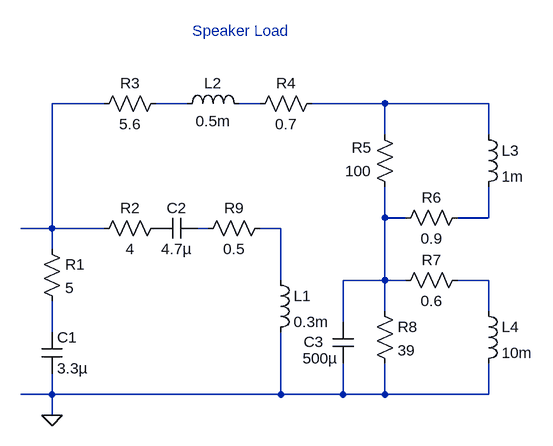
[diagram p0: schematic SpeakerLoad.asc]
SpeakerLoad.asc, the LTspice schematic file:
Version 4
SHEET 1 1868 1444
WIRE 1120 1136 1072 1136
WIRE 1120 1136 1120 944
WIRE 1120 1168 1120 1136
WIRE 1120 1296 1120 1248
WIRE 1120 1392 1072 1392
WIRE 1120 1392 1120 1360
WIRE 1120 1424 1120 1392
WIRE 1200 944 1120 944
WIRE 1200 1136 1120 1136
WIRE 1328 944 1280 944
WIRE 1360 1136 1344 1136
WIRE 1440 944 1408 944
WIRE 1472 1136 1440 1136
WIRE 1472 1216 1472 1136
WIRE 1472 1392 1120 1392
WIRE 1472 1392 1472 1296
WIRE 1568 1280 1568 1216
WIRE 1568 1392 1472 1392
WIRE 1568 1392 1568 1344
WIRE 1632 944 1520 944
WIRE 1632 992 1632 944
WIRE 1632 1120 1632 1072
WIRE 1632 1216 1568 1216
WIRE 1632 1216 1632 1120
WIRE 1632 1264 1632 1216
WIRE 1632 1392 1568 1392
WIRE 1632 1392 1632 1344
WIRE 1664 1120 1632 1120
WIRE 1664 1216 1632 1216
WIRE 1792 944 1632 944
WIRE 1792 992 1792 944
WIRE 1792 1120 1744 1120
WIRE 1792 1120 1792 1072
WIRE 1792 1216 1744 1216
WIRE 1792 1264 1792 1216
WIRE 1792 1392 1632 1392
WIRE 1792 1392 1792 1344
FLAG 1120 1424 0
SYMBOL res 1104 1152 R0
SYMATTR InstName R1
SYMATTR Value 5
SYMBOL res 1296 1120 R90
WINDOW 0 0 56 VBottom 0
WINDOW 3 32 56 VTop 0
SYMATTR InstName R2
SYMATTR Value 4
SYMBOL res 1296 928 R90
WINDOW 0 0 56 VBottom 0
WINDOW 3 32 56 VTop 0
SYMATTR InstName R3
SYMATTR Value 5.6
SYMBOL res 1536 928 R90
WINDOW 0 0 56 VBottom 0
WINDOW 3 32 56 VTop 0
SYMATTR InstName R4
SYMATTR Value 0.7
SYMBOL res 1648 1088 R180
WINDOW 0 36 76 Left 0
WINDOW 3 36 40 Left 0
SYMATTR InstName R5
SYMATTR Value 100
SYMBOL res 1648 1136 R270
WINDOW 0 32 56 VTop 0
WINDOW 3 0 56 VBottom 0
SYMATTR InstName R6
SYMATTR Value 0.9
SYMBOL res 1648 1232 R270
WINDOW 0 32 56 VTop 0
WINDOW 3 0 56 VBottom 0
SYMATTR InstName R7
SYMATTR Value 0.6
SYMBOL res 1616 1248 R0
SYMATTR InstName R8
SYMATTR Value 39
SYMBOL res 1456 1120 R90
WINDOW 0 0 56 VBottom 0
WINDOW 3 32 56 VTop 0
SYMATTR InstName R9
SYMATTR Value 0.5
SYMBOL cap 1104 1296 R0
SYMATTR InstName C1
SYMATTR Value 3.3µ
SYMBOL cap 1344 1120 R90
WINDOW 0 0 32 VBottom 0
WINDOW 3 32 32 VTop 0
SYMATTR InstName C2
SYMATTR Value 4.7µ
SYMBOL cap 1584 1344 R180
WINDOW 0 46 33 Left 0
WINDOW 3 24 8 Left 0
SYMATTR InstName C3
SYMATTR Value 500µ
SYMBOL ind 1456 1200 R0
SYMATTR InstName L1
SYMATTR Value 0.3m
SYMBOL ind 1312 960 R270
WINDOW 0 32 56 VTop 0
WINDOW 3 5 56 VBottom 0
SYMATTR InstName L2
SYMATTR Value 0.5m
SYMBOL ind 1776 976 R0
SYMATTR InstName L3
SYMATTR Value 1m
SYMBOL ind 1776 1248 R0
SYMATTR InstName L4
SYMATTR Value 10m
TEXT 1336 832 Left 0 ;Speaker Load

The netlist it stands for:
* SpeakerLoad.asc
R1 N001 N002 5
R2 P001 N001 4
R3 N003 N001 5.6
R4 N008 N005 0.7
R5 N007 N008 100
R6 N007 N009 0.9
R7 N007 N010 0.6
R8 N007 0 39
R9 N006 N004 0.5
C1 N002 0 3.3µ
C2 N004 P001 4.7µ
C3 0 N007 500µ
L1 N006 0 0.3m
L2 N003 N005 0.5m
L3 N008 N009 1m
L4 N010 0 10m
* Speaker Load
.backanno
.end